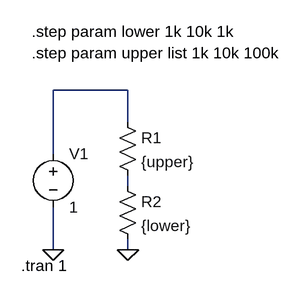
[diagram p0: schematic EP3_step.asc]
EP3_step.asc, the LTspice schematic file:
Version 4.1
SHEET 1 880 680
WIRE 224 -32 112 -32
WIRE 224 16 224 -32
WIRE 112 64 112 -32
WIRE 224 112 224 96
WIRE 112 208 112 144
WIRE 224 208 224 192
FLAG 112 208 0
FLAG 224 208 0
SYMBOL voltage 112 48 R0
SYMATTR InstName V1
SYMATTR Value 1
SYMBOL res 208 0 R0
SYMATTR InstName R1
SYMATTR Value {upper}
SYMBOL res 208 96 R0
SYMATTR InstName R2
SYMATTR Value {lower}
TEXT 80 -88 Left 2 !.step param upper list 1k 10k 100k
TEXT 80 -120 Left 2 !.step param lower 1k 10k 1k
TEXT 64 232 Left 2 !.tran 1

The netlist it stands for:
* EP3_step.asc
V1 N001 0 1
R1 N001 N002 {upper}
R2 N002 0 {lower}
.step param upper list 1k 10k 100k
.step param lower 1k 10k 1k
.tran 1
.backanno
.end